# Altium schematic sheet adc.schdoc: 基于TLC5510带偏置的模数转换电路
size A4; DrawnBy: Athurg Gooth; DocumentNumber: 1; Revision: 1; SheetNumber: 1
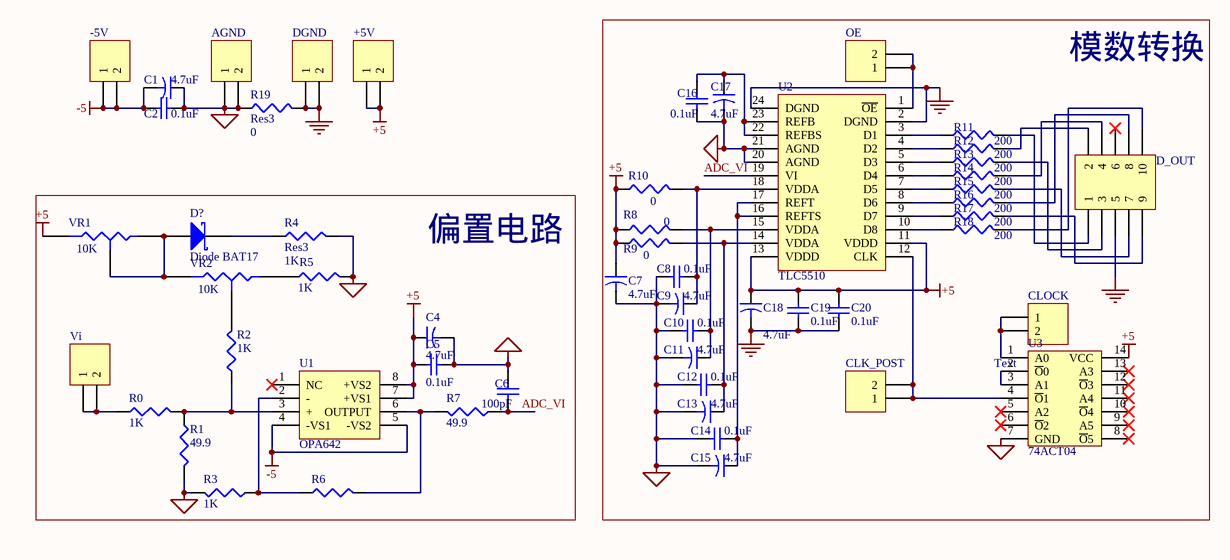
[diagram p0: adc.schdoc]

## Parts
+5V  5V  [HDR1X2]  (value not drawn)
-5V  -5V  [HDR1X2]  (value not drawn)
AGND  AGND  [HDR1X2]  (value not drawn)
C1  value 4.7uF  [CR3225-1210]
C2  value 0.1uF  [CC2012-0805]
C4  value 4.7uF  [CR3225-1210]
C5  value 0.1uF  [CC2012-0805]
C6  value 100pF  [CR3216-1206]
C7  value 4.7uF  [CR3225-1210]
C8  value 0.1uF  [CC2012-0805]
C9  value 4.7uF  [CR3225-1210]
C10  value 0.1uF  [CC2012-0805]
C11  value 4.7uF  [CR3225-1210]
C12  value 0.1uF  [CC2012-0805]
C13  value 4.7uF  [CR3225-1210]
C14  value 0.1uF  [CC2012-0805]
C15  value 4.7uF  [CR3225-1210]
C16  value 0.1uF  [CC2012-0805]
C17  value 4.7uF  [CR3225-1210]
C18  value 4.7uF  [CR3225-1210]
C19  value 0.1uF  [CC2012-0805]
C20  value 0.1uF  [CC2012-0805]
CLK_POST  CLOCK  [HDR1X2]  (value not drawn)
CLOCK  CLOCK  [HDR1X2]  (value not drawn)
D?  Diode BAT17  [PIN3]
D_OUT  D_OUT  [HDR2X5]  (value not drawn)
DGND  DGND  [HDR1X2]  (value not drawn)
OE  OE  [HDR1X2]  (value not drawn)
R0  value 1K  [CC2012-0805]
R1  value 49.9  [CC2012-0805]
R2  value 1K  [CC2012-0805]
R3  value 1K  [CC2012-0805]
R4  Res3  value 1K  [C1608-0603]
R5  value 1K  [CC2012-0805]
R6  (no value)  [CC2012-0805]
R7  value 49.9  [CC2012-0805]
R8  value 0  [CC2012-0805]
R9  value 0  [CC2012-0805]
R10  value 0  [CC2012-0805]
R11  value 200  [CC2012-0805]
R12  value 200  [CC2012-0805]
R13  value 200  [CC2012-0805]
R14  value 200  [CC2012-0805]
R15  value 200  [CC2012-0805]
R16  value 200  [CC2012-0805]
R17  value 200  [CC2012-0805]
R18  value 200  [CC2012-0805]
R19  Res3  value 0  [C1608-0603]
U1  OPA642  [DIP-8]
U2  TLC5510  [SOP-24 - duplicate3]
U3  74ACT04  [SOP-14]
Vi  Vi  [HDR1X2]  (value not drawn)
VR1  value 10K  [HDR1X3]  (hidden comment: Res Tap)
VR2  value 10K  [HDR1X3]  (hidden comment: Res Tap)

## Blocks framed on the sheet
模数转换: C7-C20 CLK_POST CLOCK D_OUT OE R8-R18 U2 U3
偏置电路: C4-C6 D? R0-R7 U1 Vi VR1 VR2

## Nets
+5: +5V.1 +5V.2 C4.1 C5.1 C7.1 C18.1 C19.2 C20.2 R8.1 R9.1 R10.1 U1.7(+VS1) U1.8(+VS2) U2.11(VDDD) U2.13(VDDD) U3.14(VCC) VR1.2(B)
-5: -5V.1 -5V.2 C1.2 C2.1 U1.4(-VS1) U1.5(-VS2)
AGND: AGND.1 AGND.2 C1.1 C2.2 C4.2 C5.2 C6.1 C7.2 C8.1 C9.2 C10.1 C11.2 C12.1 C13.2 C14.1 C15.2 C16.1 C17.2 R1.2 R3.2 R4.2 R5.2 R19.1 U2.20(AGND) U2.21(AGND) U3.7(GND)
DGND: C18.2 C19.1 C20.1 D_OUT.5 DGND.1 DGND.2 R19.2 U2.2(DGND) U2.24(DGND)
ADC_VI: C6.2 R7.1 U2.19(VI)
NetC8_2: C8.2 C9.1 R10.2 U2.18(VDDA)
NetC10_2: C10.2 C11.1 R8.2 U2.15(VDDA)
NetC12_2: C12.2 C13.1 R9.2 U2.14(VDDA)
NetC14_2: C14.2 C15.1 U2.16(REFTS) U2.17(REFT)
NetC16_2: C16.2 C17.1 U2.22(REFBS) U2.23(REFB)
NetCLK_POST_1: CLK_POST.1 CLK_POST.2 U2.12(CLK) U3.4(~{O}1)
NetCLOCK_1: CLOCK.1 CLOCK.2 U3.1(A0)
NetD?_1: D?.1(A) VR1.1(A) VR1.3(TAP) VR2.2(B)
NetD?_3: D?.3(K) R4.1
NetD_OUT_1: D_OUT.1 R11.2
NetD_OUT_2: D_OUT.2 R12.2
NetD_OUT_3: D_OUT.3 R13.2
NetD_OUT_4: D_OUT.4 R14.2
NetD_OUT_7: D_OUT.7 R15.2
NetD_OUT_8: D_OUT.8 R16.2
NetD_OUT_9: D_OUT.9 R17.2
NetD_OUT_10: D_OUT.10 R18.2
NetOE_1: OE.1 OE.2 U2.1(~{OE})
NetR0_1: R0.1 Vi.1 Vi.2
NetR0_2: R0.2 R1.1 R2.1 U1.3(+)
NetR2_2: R2.2 VR2.3(TAP)
NetR3_1: R3.1 R6.1 U1.2(-)
NetR5_1: R5.1 VR2.1(A)
NetR6_2: R6.2 R7.2 U1.6(OUTPUT)
NetR11_1: R11.1 U2.3(D1)
NetR12_1: R12.1 U2.4(D2)
NetR13_1: R13.1 U2.5(D3)
NetR14_1: R14.1 U2.6(D4)
NetR15_1: R15.1 U2.7(D5)
NetR16_1: R16.1 U2.8(D6)
NetR17_1: R17.1 U2.9(D7)
NetR18_1: R18.1 U2.10(D8)
NetU3_2: U3.2(~{O}0) U3.3(A1)

Not connected (* = marked no-connect by the designer): D_OUT 6*; U1 1(NC)*; U3 5(A2)* 6(~{O}2)* 8(~{O}5)* 9(A5)* 10(~{O}4)* 11(A4)* 12(~{O}3)* 13(A3)*

## Notes on the sheet
- (near U3) Text

## Library data of the parts
+5V -5V AGND CLK_POST CLOCK DGND OE Vi = Header 2: Header, 2-Pin; Revision: 17-Jul-2002: Re-released for DXP Platform.; Publisher: Altium Limited
C1 C4 C7 C9 C11 C13 C15 C17 C18 = Cap2: Capacitor; Published: 23-Sep-2002; Publisher: Altium Limited
C2 C5 C6 C8 C10 C12 C14 C16 C19 C20 = Cap: Capacitor; Published: 8-Jun-2000; Revision: July-2002: Re-released for DXP Platform.; Publisher: Altium Limited
D? = Diode BAT17: Silicon RF Schottky Diode for Mixer Applications in the VHF/UHF Range; pin to pad: 3>2; Package Information: Latest Revision: Sep-2001; Note: Pin 2 is not connected and not drawn.; Published: 21-Mar-2003; Datasheet: Latest Revision: Oct-1999; Package Reference: SOT-23; Publisher: Altium Limited
D_OUT = Header 5X2: Header, 5-Pin, Dual row; Revision: 17-Jul-2002: Re-released for DXP Platform.; Publisher: Altium Limited
R0-R19 = Res3: Resistor; Published: 8-Jun-2000; Revision: July-2002: Re-released for DXP Platform.; Publisher: Altium Limited
VR1 VR2 = Res Tap: Tapped Resistor; pin to pad: 2>3 3>2; Set Position: 0.5; Published: 24-Mar-1999; Revision: July-2002: Re-released for DXP Platform.; Publisher: Altium Limited